# EAGLE design acdr_3.2 (EAGLE 9.6.2)
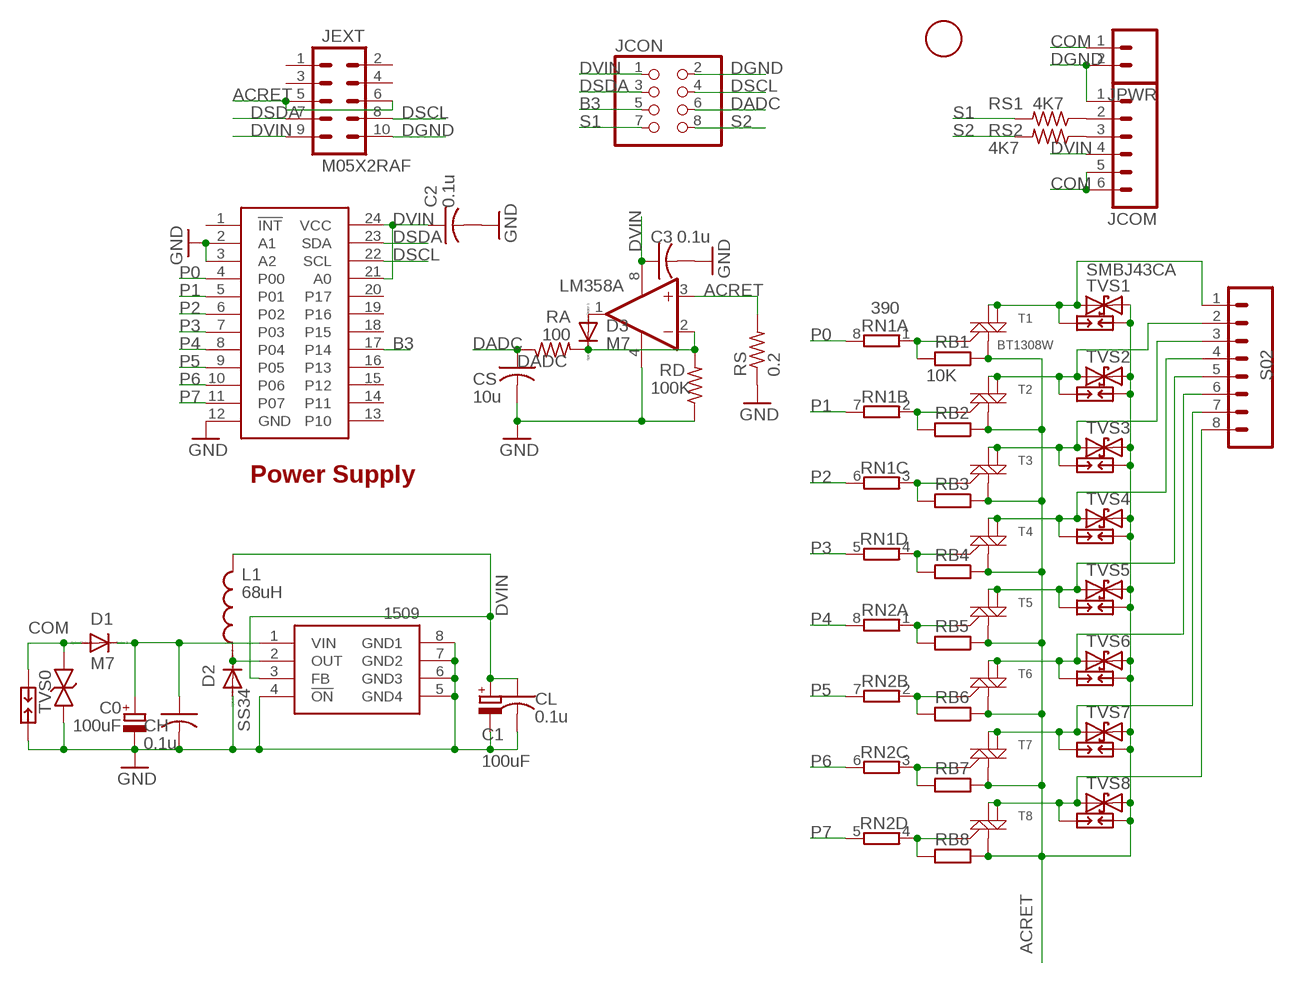
[diagram p0: schematic, sheet 1]

## Parts
1F  FIDUCIAL  [FIDUCIAL_1MM]
1509  34063  XL1509  [SO08]
C0  100uF  CPOL-EUE  [PANASONIC_E]
C1  100uF  CPOL-EUD  [PANASONIC_D]
C2  0.1u  C-USC0603  [C0603]
C3  0.1u  C-USC0603  [C0603]
CH  0.1u  C-USC0603  [C0603]
CL  0.1u  C-USC0603  [C0603]
CS  10u  C-USC0805K  [C0805K]
D1  M7  DIODE-DO-214AC  [DO-214AC]
D2  SS34  DIODE-SMB  [SMB]
D3  M7  DIODE-DO-214AC  [DO-214AC]
JCOM  M065MM  [SCREWTERMINAL-5MM-6]
JCON  PINHD-2X4  [2X04]
JEXT  M05X2RAF  [2X5-RAF]
JPWR  M024MM-X  [SCREWTERMINAL-4MM-2-X]
L1  68uH  INDUCTORPWR  [CDRH125]
LM358  OP262D  [SO08]
PCA9555  PCA9555  PCF8575TSSOP24  [TSSOP24]
RA  100  R-US_R0603  [R0603]
RB1  10K  R-EU_R0603  [R0603]
RB2  10K  R-EU_R0603  [R0603]
RB3  10K  R-EU_R0603  [R0603]
RB4  10K  R-EU_R0603  [R0603]
RB5  10K  R-EU_R0603  [R0603]
RB6  10K  R-EU_R0603  [R0603]
RB7  10K  R-EU_R0603  [R0603]
RB8  10K  R-EU_R0603  [R0603]
RD  100K  R-US_R0603  [R0603]
RN1  390  4R-NEXB38V  [EXB38V]
RN2  4R-NEXB38V  [EXB38V]
RS  0.2  R-US_R2512  [R2512]
RS1  4K7  R-US_R0603  [R0603]
RS2  4K7  R-US_R0603  [R0603]
S02  M085MM-8  [SCREWTERMINAL-5MM-8]
SP0  PCB-SGAP  [PCB-SGAP]
SP1  PCB-SGAP  [PCB-SGAP]
SP2  PCB-SGAP  [PCB-SGAP]
SP3  PCB-SGAP  [PCB-SGAP]
SP4  PCB-SGAP  [PCB-SGAP]
SP5  PCB-SGAP  [PCB-SGAP]
SP6  PCB-SGAP  [PCB-SGAP]
SP7  PCB-SGAP  [PCB-SGAP]
SP8  PCB-SGAP  [PCB-SGAP]
T1  BT1308W  MAC97SOT223  [SOT223]
T2  MAC97SOT223  [SOT223]
T3  MAC97SOT223  [SOT223]
T4  MAC97SOT223  [SOT223]
T5  MAC97SOT223  [SOT223]
T6  MAC97SOT223  [SOT223]
T7  MAC97SOT223  [SOT223]
T8  MAC97SOT223  [SOT223]
TVS0  43CA  DIODE-BTVSSMB  [SMB]
TVS1  SMBJ43CA  TVSSMB  [SMB]
TVS2  TVSSMB  [SMB]
TVS3  TVSSMB  [SMB]
TVS4  TVSSMB  [SMB]
TVS5  TVSSMB  [SMB]
TVS6  TVSSMB  [SMB]
TVS7  TVSSMB  [SMB]
TVS8  TVSSMB  [SMB]

## Nets
ACRET: JEXT.5 JEXT.6 LM358.3(A:+IN) RB1.1 RB2.1 RB3.1 RB4.1 RB5.1 RB6.1 RB7.1 RB8.1 RS.2 SP1.1 SP2.1 SP3.1 SP4.1 SP5.1 SP6.1 SP7.1 SP8.1 T1.1(M1) T2.1(M1) T3.1(M1) T4.1(M1) T5.1(M1) T6.1(M1) T7.1(M1) T8.1(M1) TVS1.C TVS2.C TVS3.C TVS4.C TVS5.C TVS6.C TVS7.C TVS8.C
B3: JCON.5 PCA9555.17(P14)
COM [power]: D1.A JCOM.5 JCOM.6 JPWR.1 SP0.1 TVS0.C
DADC [signal]: CS.1 JCON.6 RA.1
DGND [power]: 1509.4(!ON) 1509.5(GND4) 1509.6(GND3) 1509.7(GND2) 1509.8(GND1) C0.- C1.- C3.2 CH.2 CL.2 CS.2 D2.A JCOM.1 JCON.2 JEXT.10 JPWR.2 LM358.4(P:V-) PCA9555.2(A1) PCA9555.3(A2) PCA9555.12(GND) RD.1 RS.1 SP0.2 TVS0.A ; supply symbol labelled GND
DSCL [signal]: JCON.4 JEXT.8 PCA9555.22(SCL)
DSDA [signal]: JCON.3 JEXT.7 PCA9555.23(SDA)
DVIN [power]: 1509.3(FB) C1.+ C2.1 C3.1 CL.1 JCOM.4 JCON.1 JEXT.9 L1.2 LM358.8(P:V+) PCA9555.21(A0) PCA9555.24(VCC)
GND [power]: C2.2
N$1: JCOM.2 RS1.1
N$3: JCOM.3 RS2.1
N$7: D3.C LM358.2(A:-IN) RA.2 RD.2
N$8: RB1.2 RN1.1 T1.3(G)
N$9: RB2.2 RN1.2 T2.3(G)
N$15: RB3.2 RN1.3 T3.3(G)
N$16: RB4.2 RN1.4 T4.3(G)
N$18: RB5.2 RN2.1 T5.3(G)
N$19: RB6.2 RN2.2 T6.3(G)
N$21: RB7.2 RN2.3 T7.3(G)
N$22: RB8.2 RN2.4 T8.3(G)
N$27: 1509.2(OUT) D2.C L1.1
N$43: D3.A LM358.1(A:OUT)
N$50 [power]: S02.1 SP1.2 T1.2(M2) T1.4(M2-4) TVS1.A
N$51 [power]: S02.2 SP2.2 T2.2(M2) T2.4(M2-4) TVS2.A
N$52 [power]: S02.3 SP3.2 T3.2(M2) T3.4(M2-4) TVS3.A
N$53 [power]: S02.4 SP4.2 T4.2(M2) T4.4(M2-4) TVS4.A
N$54 [power]: S02.5 SP5.2 T5.2(M2) T5.4(M2-4) TVS5.A
N$55 [power]: S02.6 SP6.2 T6.2(M2) T6.4(M2-4) TVS6.A
N$56 [power]: S02.7 SP7.2 T7.2(M2) T7.4(M2-4) TVS7.A
N$57 [power]: S02.8 SP8.2 T8.2(M2) T8.4(M2-4) TVS8.A
P0: PCA9555.4(P00) RN1.8
P1: PCA9555.5(P01) RN1.7
P2: PCA9555.6(P02) RN1.6
P3: PCA9555.7(P03) RN1.5
P4: PCA9555.8(P04) RN2.8
P5: PCA9555.9(P05) RN2.7
P6: PCA9555.10(P06) RN2.6
P7: PCA9555.11(P07) RN2.5
RECAC [power]: 1509.1(VIN) C0.+ CH.1 D1.C
S1 [signal]: JCON.7 RS1.2
S2 [signal]: JCON.8 RS2.2
Unconnected: JEXT.1 JEXT.2 JEXT.3 JEXT.4 LM358.5(B:+IN) LM358.6(B:-IN) LM358.7(B:OUT) PCA9555.1(!INT) PCA9555.13(P10) PCA9555.14(P11) PCA9555.15(P12) PCA9555.16(P13) PCA9555.18(P15) PCA9555.19(P16) PCA9555.20(P17)

## Notes on the sheet
- Power Supply

## Library data of the parts
1F = adafruitGood:FIDUCIAL: For use by pick and place machines to calibrate the vision/machine, 1mm By microbuilder.eu
1509 = adafruit:XL1509
C0 C1 = resistor:CPOL-EU: POLARIZED CAPACITOR, European symbol
C2 C3 CH CL CS = adafruit:C-US: CAPACITOR, American symbol
D1-D3 = diode:DIODE-: DIODE
JCOM = SparkFun:M06: Header 6 Standard 6-pin 0.1" header. Use with straight break away headers (SKU : PRT-00116), right angle break away headers (PRT-00553), swiss pins (PRT-00743), machine pins (PRT-00117), and female headers (PRT-00115). Molex polarized connector foot print use with SKU : PRT-08094 with associated crimp pins and housings. NOTES ON THE VARIANTS LOCK and LOCK_LONGPADS... This footprint was designed to help hold the alignment of a through-hole component (i.e. 6-pin header) while soldering it into place. You may notice that each hole has been shifted either up or down by 0.005 of an inch from it's more standard position (which is a perfectly straight line). This slight alteration caused the pins (the squares in the middle) to touch the edges of the holes. Because they are alternating, it causes a "brace" to hold the component in place. 0.005 has proven to be the perfect amount of "off-center" position when using our standard breakaway headers. Although looks a little odd when you look at the bare footprint, once you have a header in there, the alteration is very hard to notice. Also, if you push a header all the way into place, it is covered up entirely on the bottom side. This idea of altering the position of holes to aid alignment will be further integrated into the Sparkfun Library for other footprints. It can help hold any component with 3 or more connection pins.
JCON = pinhead:PINHD-2X4: PIN HEADER
JEXT = SparkFunNew:M05X2: Header 5x2 Standard 10-pin dual row 0.1" header. Commonly used with AVR-ISP. Use with Spark Fun Electronics SKU: PRT-00778
JPWR = SparkFun:M02: Header 2 Standard 2-pin 0.1" header. Use with straight break away headers (SKU : PRT-00116), right angle break away headers (PRT-00553), swiss pins (PRT-00743), machine pins (PRT-00117), and female headers (PRT-00115). Molex polarized connector foot print use with SKU : PRT-08233 with associated crimp pins and housings.
L1 = SparkFunNew:INDUCTOR: Inductors Basic Inductor/Choke - 0603 and 1206. Footprints are not proven and vary greatly between part numbers.
LM358 = linear:OP262: OP AMP
PCA9555 = SparkFunNew:PCF8575
RA RD RS RS1 RS2 = adafruit2013:R-US_: RESISTOR, American symbol
RB1-RB8 = rcl:R-EU_: RESISTOR, European symbol
RN1 RN2 = resistor-dil:4R-N: Array Chip Resistor Source: RS Component / Phycomp; OC_FARNELL: unknown; OC_NEWARK: unknown
S02 = SparkFun:M08: Header 8 Standard 8-pin 0.1" header. Use with straight break away headers (SKU : PRT-00116), right angle break away headers (PRT-00553), swiss pins (PRT-00743), machine pins (PRT-00117), and female headers (PRT-00115).
SP0 SP1-SP8 = varistor:PCB-SGAP
T1-T8 = SparkFun:MAC97: MAC97 Triac http://www.onsemi.com/pub_link/Collateral/MAC97-D.PDF
TVS0 = diode:DIODE-BTVS
TVS1-TVS8 = SparkFunNew:TVS

## Net classes
0 default: width 0.203 mm, clearance 0.178 mm
1 power: width 0.203 mm, clearance 0.178 mm
2 relaypower: width 0.203 mm, clearance 0.178 mm
3 signal: width 0.203 mm, clearance 0.178 mm
4 adc: width 0.406 mm, clearance 0.178 mm

## Board
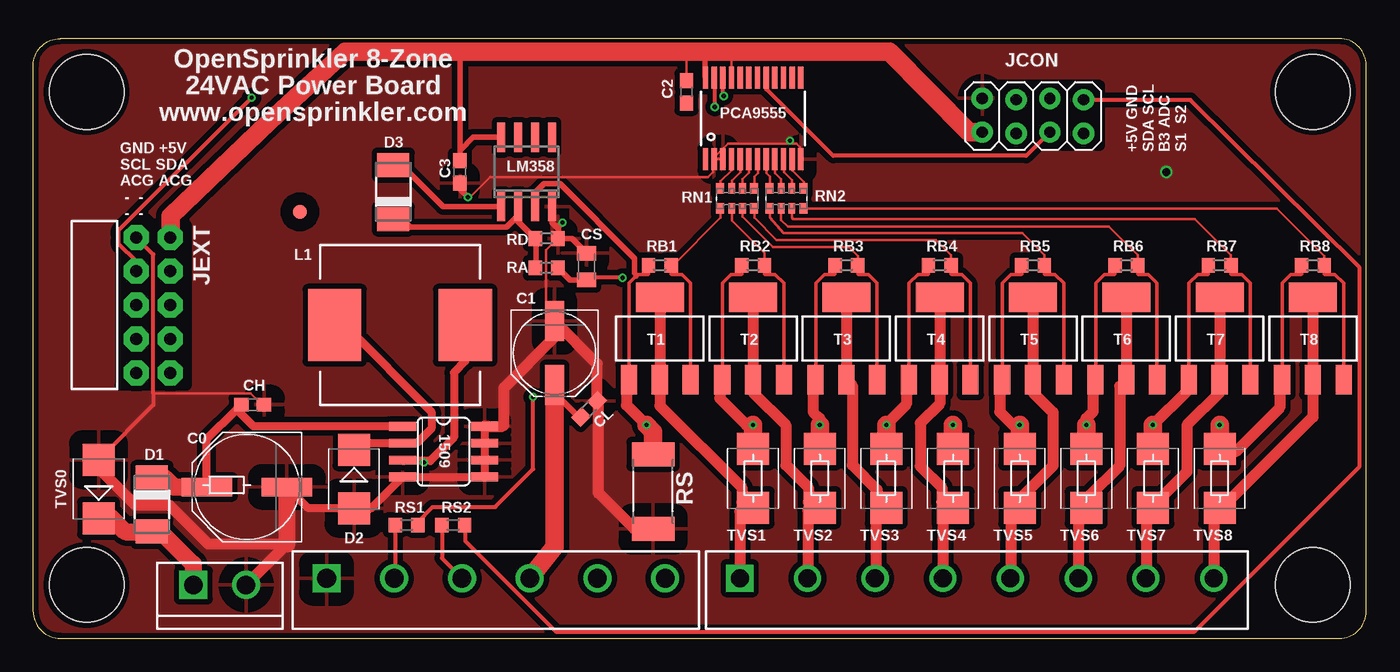
[diagram p1: board, top side]
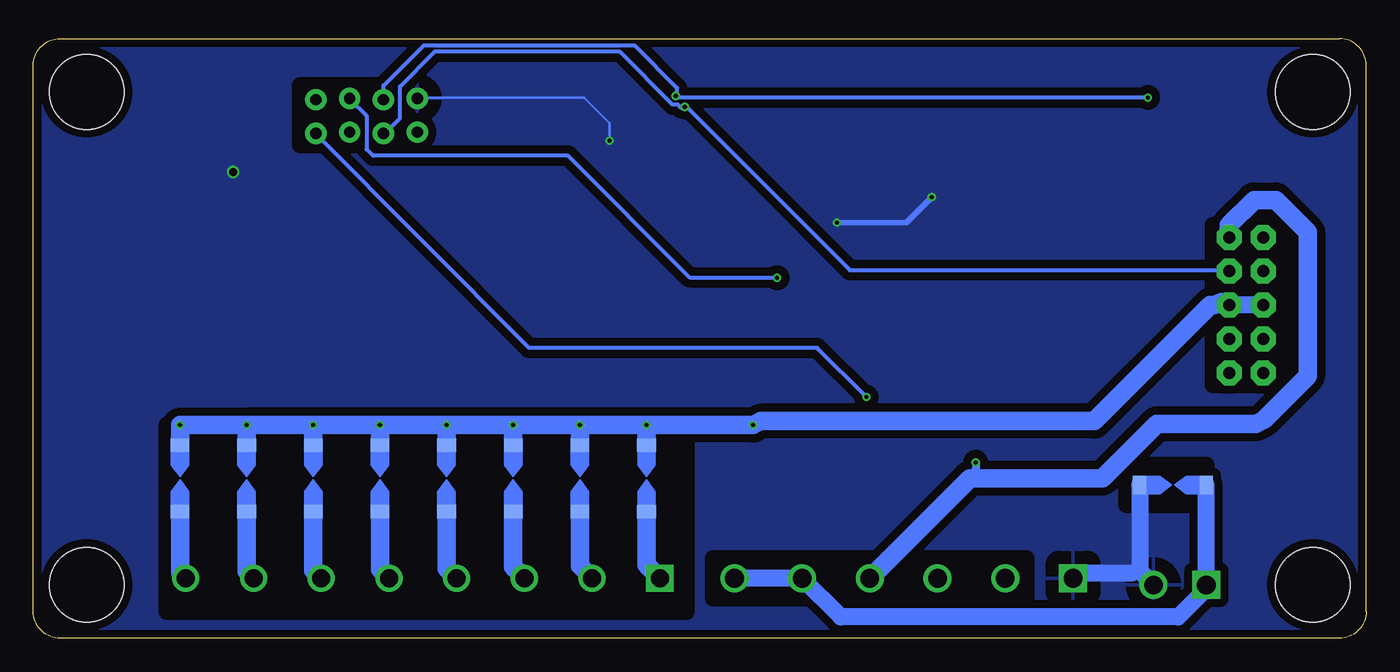
[diagram p2: board, bottom side, seen from below]

Size 100 x 45 mm. Coordinates in mm from the lower left corner, seen from the top.
Outline: 2,0 98,0 arc90 100,2 100,43 arc90 98,45 2,45 arc90 0,43 0,2 arc90 2,0
Copper layers (1*16): Top 0.035mm / dielectric 1.5mm / Bottom 0.035mm
Design rules "Fusion_eagle_rule_v1.1 *": minimum track width 6mil, minimum drill 12mil, track to track 6mil, track to pad 6mil, pad to pad 6mil, via to via 6mil, smd to smd 0mil, copper to edge 10mil, drill to drill 10mil, minimum pad ring 10mil, minimum via ring 6mil, stop-mask expansion 2mil, vias tented up to drill 100mil, thermal gap 40mil
Holes 5.6 mm at 4,4 96,4 4,41 96,41
tRestrict: area 72.5,37 to 80,41.5; area 6.5,19 to 11.5,31
bRestrict: area 51,2 to 90,16; area 12,10 to 18,13; area 72.5,37 to 80,41.5; area 6.5,19 to 11.5,31; area 25.5,3 to 49,6

### Footprints (pad centres in the part's own frame; a part is rotated, then mirrored left to right if it is on the bottom)
FIDUCIAL_1MM = smd 1 x 1: 1 0,0
SO08 = smd 0.66 x 2.032: 1 -1.905,-3.073; 2 -0.635,-3.073; 3 0.635,-3.073; 4 1.905,-3.073; 5 1.905,3.073; 6 0.635,3.073; 7 -0.635,3.073; 8 -1.905,3.073
PANASONIC_E = smd 3.8 x 1.4: + 3,0; - -3,0
PANASONIC_D = smd 3 x 1.4: + 2.4,0; - -2.4,0
C0603 = smd 1.1 x 1: 1 -0.85,0; 2 0.85,0
C0805K = smd 1.1 x 1.4: 1 -1,0; 2 1,0
DO-214AC = smd 1.8 x 2.4: A 2.025,0; C -2.025,0
SMB = smd 2.4 x 2.4: A 2.2,0; C -2.2,0
SCREWTERMINAL-5MM-6 = drill 1.4 pad 2.032 square: 1 0,0 | drill 1.4 pad 2.032: 2 5.08,0; 3 10.16,0; 4 15.24,0; 5 20.32,0; 6 25.4,0
2X04 = drill 0.85 pad 1.6: 1 -3.81,-1.219; 2 -3.81,1.321; 3 -1.27,-1.321; 4 -1.27,1.219; 5 1.27,-1.219; 6 1.27,1.321; 7 3.81,-1.321; 8 3.81,1.219
2X5-RAF = drill 0.9 pad 1.88 octagon: 1 -1.27,5.08; 2 1.27,5.08; 3 -1.27,2.54; 4 1.27,2.54; 5 -1.27,0; 6 1.27,0; 7 -1.27,-2.54; 8 1.27,-2.54; 9 -1.27,-5.08; 10 1.27,-5.08
SCREWTERMINAL-4MM-2-X = drill 1.4 pad 2.032 square: 1 0,0 | drill 1.4 pad 2.032: 2 3.96,0
CDRH125 = smd 5.4 x 4: 1 0,4.9; 2 0,-4.9
SO08' = smd 0.6 x 2.2: 1 -1.905,-2.6; 2 -0.635,-2.6; 3 0.635,-2.6; 4 1.905,-2.6; 5 1.905,2.6; 6 0.635,2.6; 7 -0.635,2.6; 8 -1.905,2.6
TSSOP24 = smd 0.4 x 1.65: 1 -3.575,-3.05; 2 -2.925,-3.05; 3 -2.275,-3.05; 4 -1.625,-3.05; 5 -0.975,-3.05; 6 -0.325,-3.05; 7 0.325,-3.05; 8 0.975,-3.05; 9 1.625,-3.05; 10 2.275,-3.05; 11 2.925,-3.05; 12 3.575,-3.05; 13 3.575,3.05; 14 2.925,3.05; 15 2.275,3.05; 16 1.625,3.05; 17 0.975,3.05; 18 0.325,3.05; 19 -0.325,3.05; 20 -0.975,3.05; 21 -1.625,3.05; 22 -2.275,3.05; 23 -2.925,3.05; 24 -3.575,3.05
R0603 = smd 1 x 1.1: 1 -0.85,0; 2 0.85,0
EXB38V = smd 0.6 x 0.8: 1 -1.275,-0.75; 4 1.275,-0.75; 5 1.275,0.75; 8 -1.275,0.75 | smd 0.5 x 0.8: 2 -0.4,-0.75; 3 0.4,-0.75; 6 0.4,0.75; 7 -0.4,0.75
R2512 = smd 1.8 x 3.2: 1 -2.8,0; 2 2.8,0
SCREWTERMINAL-5MM-8 = drill 1.35 pad 2.032 square: 1 0,0 | drill 1.35 pad 2.032: 2 5.08,0; 3 10.16,0; 4 15.24,0; 5 20.32,0; 6 25.4,0; 7 30.48,0; 8 35.56,0
PCB-SGAP = smd 1 x 1.4 bottom: 1 -2.5,0; 2 2.5,0
SOT223 = smd 1.219 x 2.235: 1 -2.311,-3.099; 2 0,-3.099; 3 2.311,-3.099 | smd 3.6 x 2.2: 4 0,3.099

### Placement (x,y rotation side)
1F  20,32 0 top
1509  30.77,14 270 top
C0  16.02,11.35 180 top
C1  39.1,21.4 270 top
C2  49,41 270 top
C3  32,35 270 top
CH  16.46,17.53 0 top
CL  41.7,17.2 45 top
CS  41.5,27.9 90 top
D1  8.89,10.04 270 top
D2  24.05,11.95 270 top
D3  27,33.5 90 top
JCOM  22,4.5 0 top
JCON  75,39.2 0 top
JEXT  9,25 180 top
JPWR  12,4 0 top
L1  27.5,23.5 90 top
LM358  [SO08']  37,35 0 top
PCA9555  54,39 0 top
RA  38.5,27.8 180 top
RB1  47,28 0 top
RB2  54,28 0 top
RB3  61,28 0 top
RB4  68,28 0 top
RB5  75,28 0 top
RB6  82,28 0 top
RB7  89,28 0 top
RB8  96,28 0 top
RD  38.5,30 180 top
RN1  52.8,33 0 top
RN2  56.5,33 0 top
RS  46.5,11 90 top
RS1  28,8.5 0 top
RS2  31.5,8.5 0 top
S02  53,4.5 0 top
SP0  14.5,11.5 0 top
SP1  54,12 270 top
SP2  59,12 270 top
SP3  64,12 270 top
SP4  69,12 270 top
SP5  74,12 270 top
SP6  79,12 270 top
SP7  84,12 270 top
SP8  89,12 270 top
T1  47,22.5 0 top
T2  54,22.5 0 top
T3  61,22.5 0 top
T4  68,22.5 0 top
T5  75,22.5 0 top
T6  82,22.5 0 top
T7  89,22.5 0 top
T8  96,22.5 0 top
TVS0  4.9,11.2 90 top
TVS1  54,12 270 top
TVS2  59,12 270 top
TVS3  64,12 270 top
TVS4  69,12 270 top
TVS5  74,12 270 top
TVS6  79,12 270 top
TVS7  84,12 270 top
TVS8  89,12 270 top

### Tracks (layer width: path | path; a pad name or v marks a point on that pad's centre or on a via)
ACRET  (via drill 0.3)
  Top 0.254: RB1.1 46.15,27.35 46.1,27.3 45.35,27.3 45.22,27.17 44.7,26.65 44.7,19.8 T1.1 | RB2.1 53.15,27.35 53.1,27.3 52.35,27.3 51.7,26.65 51.7,19.8 T2.1 | RB3.1 60.15,27.35 60.1,27.3 59.35,27.3 58.7,26.65 58.7,19.8 T3.1 | RB4.1 67.15,27.35 67.1,27.3 66.35,27.3 65.7,26.65 65.7,19.8 T4.1 | RB5.1 74.15,27.35 74.1,27.3 73.35,27.3 72.7,26.65 72.7,19.8 T5.1 | RB6.1 81.15,27.35 81.1,27.3 80.35,27.3 79.7,26.65 79.7,19.8 T6.1 | RB7.1 88.15,27.35 88.1,27.3 87.35,27.3 86.7,26.65 86.7,19.8 T7.1 | RB8.1 95.15,27.35 95.1,27.3 94.35,27.3 93.7,26.65 93.7,19.8 T8.1
  Top 0.406: LM358.3 37.6,32.4 37.6,33.4 38.3,34.1 39.5,34.1 45.1,28.5 45.1,27.4 45.22,27.17
  Top 0.813: TVS8.C 89.5,14 90.2,14 93.5,17.3 93.5,19 T8.1 | v84,16 86.5,18.5 86.5,19 T7.1 | v79,16 79,16.5 79.5,17 79.5,19 T6.1 | v74,16 73.5,16 72.5,17 72.5,19 T5.1 | v64,16 64,16.05 65.5,17.55 65.5,19 T4.1 | v59,16 59,16.5 58.5,17 58.5,19 T3.1 | v54,16 53.5,16 51.5,18 51.5,19 T2.1 | v46,16 44.5,17.5 44.5,19 T1.1
  Top 1.4: v54,16 TVS1.C | v59,16 TVS2.C | v64,16 TVS3.C | v69,16 TVS4.C | v74,16 TVS5.C | v79,16 TVS6.C | v84,16 TVS7.C | v89,16 TVS8.C | RS.2 46.5,15.5 v46,16
  Bottom 1.27: JEXT.6 JEXT.5 10.85,25.25
  Bottom 1.4: SP1.1 v54,16 | SP2.1 v59,16 | SP3.1 v64,16 | SP4.1 v69,16 | SP5.1 v74,16 | SP6.1 v79,16 | SP7.1 v84,16 | SP8.1 v89,16 v84,16 | v79,16 v84,16 | v74,16 v79,16 | v69,16 v74,16 | v64,16 v69,16 | v59,16 v64,16 | v54,16 v59,16 | v54,16 v46,16 45.4,16.3 20.4,16.3 11.7,25 11.4,25 10.85,25.25
B3
  Top 0.305: PCA9555.17 55,42 55,41.2 60,36.2 74.5,36.2 76.2,37.9 JCON.5
COM
  Top 1.27: JPWR.1 12,5.55 9.55,8 D1.A 8.25,8 6.9,8 5.9,9 TVS0.C
  Bottom 1.27: JCOM.6 JCOM.5 39.42,1.6 14.1,1.6 12,3.7 JPWR.1 SP0.1
DADC  (via drill 0.3)
  Top 0.203: 41.62,27.05 CS.1
  Top 0.305: v44.2,27.05 41.62,27.05
  Top 0.406: CS.1 40.25,26.9 RA.1
  Bottom 0.305: v44.2,27.05 50.67,27.05 50.8,27.1 59.9,36.2 74.5,36.2 75,36.7 75,39.2 76.3,40.5 JCON.6
DGND  (via drill 0.3, 0.6)
  Top 0.203: PCA9555.3 51.62,36 51.12,36 PCA9555.2 | PCA9555.2 51,35.88 51,35 50.62,34.62 34.25,34.62 32.75,33.12 v32.6,33.1 | 56.77,37.12 52.12,37.12 51,36 PCA9555.2 | 56.77,37.12 57.25,37.12 57.5,36.88 57.5,36 PCA9555.12 | 5.14,13.72 TVS0.A | 19.05,11.34 C0.- | 56.77,37.12 v56.77,37.34 | 9,18.38 16.29,18.38 17.05,17.62 17.24,17.62 CH.2 | RD.1 39.24,29.91 38.48,29.15 38.48,24.57 39.05,24 C1.-
  Top 0.305: JEXT.10 9,28.81 9,18.38 9,17.5 TVS0.A
  Top 0.406: 39.4,30.7 39.4,30 | 39.4,30.7 38.9,31.2 LM358.4 | 39.4,30 RD.1 | 39.4,30 40.4,30 CS.2 | v39.7,31.2 39.4,30.9 39.4,30.7 | v32.6,33.1 32,33.7 C3.2 | 39.08,23.82 C1.-
  Top 0.61: 1509.8 1509.7 1509.6 1509.5 1509.4 25.36,9.75 D2.A 20.62,9.75 C0.-
  Top 0.813: TVS0.A 4.9,12.75 7.65,10 10.2,10 13.14,7.06 19.02,7.06 JPWR.2 | RS.1 45.1,8.2 42.4,10.9 42.4,17.4 CL.2 42.3,20.6 C1.- 39.2,23.2 39.1,23.1 39.1,22.6 35.3,18.8 35.3,16 35.2,15.9 34.1,15.9 1509.8
  Top 1.27: C0.- 19.02,7.06
  Bottom 0.203: v56.77,37.34 56.77,38.67 58.67,40.58 71.15,40.58 JCON.2
  Bottom 0.406: v39.7,31.2 34.5,31.2 v32.6,33.1
  Bottom 1.27: SP0.2 17,5.04 | 17,5.04 JPWR.2 | JCOM.1 21.6,4.9 17.6,4.9 17,5.04
  other vias: 85,35
  pour Top (isolate 0.406): 0,45 100,45 100,0 0,0
  pour Bottom (isolate 0.61): 0,45 100,45 100,0 0,0
DSCL  (via drill 0.3)
  Top 0.305: v16.38,40.58 6.38,30.57 6.38,29.62 7.71,28.29 7.71,27.62 JEXT.8 | v51.8,40.7 51.7,40.8 51.7,42 PCA9555.22
  Bottom 0.305: JCON.4 73.73,41.47 70.7,44.5 54.9,44.5 51.7,41.3 51.7,40.8 v51.8,40.7 51.68,40.58 v16.38,40.58
DSDA  (via drill 0.3)
  Top 0.305: v51.12,39.88 51.12,42 PCA9555.23
  Bottom 0.305: JEXT.7 10.38,27.62 38.75,27.62 51,39.88 v51.12,39.88 | 51.24,39.81 v51.12,39.88 | JCON.3 73.7,37.85 72.5,39.05 72.5,41.4 69.9,44 56,44 52.05,40.05 51.65,40.05 51.4,39.8 v51.12,39.88
DVIN  (via drill 0.3)
  Top 0.203: 49,44 C2.1 | 50.38,42.12 PCA9555.24 | 52.38,44 PCA9555.21 | 40.9,16.6 41.05,16.67 CL.1 41.05,16.76 | 39.43,19.14 39.24,19.14 39.15,19.05 | 39.15,19.05 C1.+ | 39.15,19.05 39.1,18.4
  Top 0.406: LM358.8 33,37.6 32,36.6 | C3.1 32,36.6 | 32,36.6 32,44 | 52.38,43.62 52,44 | 40.9,16.6 39.1,18.4 | 50.38,42.12 50.38,43.67 50.7,44
  Top 0.61: 29.3,13.3 29.77,13.3 31.55,15.07 31.55,19.94 32.4,20.79 L1.2 | 29.3,13.3 27.77,13.3 1509.3 | v29.3,13.2 29.3,13.3
  Top 1.4: JEXT.9 arc45 10.3,30.15 10.3,31.7 17.71,38.81 23.4,44 32,44 49,44 50.7,44 52,44 52.38,44 64.25,44 70.19,37.98 JCON.1 | 39.1,18.4 39.1,6.86 JCOM.4
  Bottom 0.61: v29.3,13.2 29.3,12.7 29.18,12.4 29.18,12
  Bottom 1.4: JEXT.9 10.3,30.1 10.3,31 8.4,32.9 6.8,32.9 4.4,30.5 4.4,19.7 7.7,16.4 8.3,16.1 15.7,16.1 19.8,12 29.18,12 29.74,12 JCOM.4
N$1
  Top 0.254: 27.15,4.57 JCOM.2
  Top 0.305: RS1.1 27.15,4.57
N$3
  Top 0.305: RS2.1 30.65,6.01 JCOM.3
N$7
  Top 0.406: RA.2 37.7,28.5 37.7,29.8 RD.2 37.5,30.14 36.28,31.36 LM358.2 36.36,31.72 35.5,30.86 28.26,30.86 27.64,31.48 D3.C
N$8
  Top 0.203: RB1.2 47.95,28.05 48.05,28.05 51.55,31.55 51.55,32.25 RN1.1
  Top 0.254: RB1.2 47.85,27.35 47.9,27.3 48.65,27.3 49.3,26.65 49.3,19.45 T1.3
N$9
  Top 0.203: RB2.2 54.85,28.9 52.4,31.35 RN1.2
  Top 0.254: RB2.2 54.85,27.35 54.9,27.3 55.65,27.3 56.3,26.65 56.3,19.45 T2.3
N$15
  Top 0.203: RN1.3 53.2,31.65 55.5,29.35 61.2,29.35 61.85,28.7 RB3.2
  Top 0.254: RB3.2 61.85,27.35 61.9,27.3 62.65,27.3 63.3,26.65 63.3,19.45 T3.3
N$16
  Top 0.203: RN1.4 54.1,32.25 54.1,31.55 55.75,29.9 67.7,29.9 68.85,28.75 RB4.2
  Top 0.254: RB4.2 68.85,27.35 68.9,27.3 69.65,27.3 70.3,26.65 70.3,19.45 T4.3
N$18
  Top 0.203: RN2.1 55.25,32.25 55.25,31.55 56.29,30.4 74.2,30.4 75.85,28.75 RB5.2
  Top 0.254: RB5.2 75.85,27.35 75.9,27.3 76.65,27.3 77.3,26.65 77.3,19.45 T5.3
N$19
  Top 0.203: RN2.2 56.1,31.4 56.6,30.9 80.7,30.9 82.85,28.75 RB6.2
  Top 0.254: RB6.2 82.85,27.35 82.9,27.3 83.65,27.3 84.3,26.65 84.3,19.45 T6.3
N$21
  Top 0.203: RN2.3 56.9,31.55 57,31.45 87.15,31.45 89.85,28.75 RB7.2
  Top 0.254: RB7.2 89.85,27.35 89.9,27.3 90.65,27.3 91.3,26.65 91.3,19.45 T7.3
N$22
  Top 0.203: 57.85,32.25 57.8,32.3 57.75,32.25 RN2.4 93.3,32.25 96.85,28.7 RB8.2
  Top 0.254: RB8.2 96.85,27.35 96.9,27.3 97.65,27.3 98.3,26.65 98.3,19.45 T8.3
N$27
  Top 0.61: D2.C 24.54,14.63 1509.2 27.73,14.66 28.8,14.66 29.88,15.74 29.88,17 23.38,23.5 L1.1
N$43
  Top 0.406: LM358.1 30.76,32.4 27.64,35.52 D3.A
N$50
  Top 0.813: S02.1 53,9.5 53.3,9.8 TVS1.A 53.15,10.2 53.15,11.3 47,17.45 T1.2 T1.4
  Bottom 1.4: SP1.2 54,5.5 S02.1
N$51
  Top 0.813: S02.2 58.1,4.5 58.1,9.6 58.3,9.8 TVS2.A 58.15,10.2 58.15,11.3 56.45,13 56.45,16 54,18.45 T2.2 T2.4
  Bottom 1.4: SP2.2 59,5.42 S02.2
N$52
  Top 0.813: S02.3 63.2,4.5 63.2,9.55 63.45,9.8 TVS3.A 63.3,10.2 63.3,11.15 61.45,13 61.45,18.95 T3.2 T3.4
  Bottom 1.4: SP3.2 64,5.34 S02.3
N$53
  Top 0.813: S02.4 68.25,9.75 68.3,9.8 TVS4.A 68.15,10.2 68.15,11.3 66.55,12.9 66.55,16.15 68,17.6 T4.2 T4.4
  Bottom 1.4: SP4.2 69,5.26 S02.4
N$54
  Top 0.813: S02.5 73.35,4.5 73.35,9.75 73.4,9.8 TVS5.A 74.15,10.2 74.15,10.6 76.5,12.95 76.5,16.95 75,18.45 T5.2 T5.4
  Bottom 1.4: SP5.2 74,5.18 S02.5
N$55
  Top 0.813: S02.6 78.4,9.75 78.45,9.8 TVS6.A 79.15,10.2 79.15,10.6 81.5,12.95 81.5,18.9 T6.2 T6.4
  Bottom 1.4: SP6.2 79,5.1 S02.6
N$56
  Top 0.813: S02.7 83.5,4.5 83.5,9.75 83.55,9.8 TVS7.A 84.09,10.04 86.55,12.5 86.55,16 89,18.45 T7.2 T7.4
  Bottom 1.4: SP7.2 84,5.02 S02.7
N$57
  Top 0.813: S02.8 88.55,9.75 88.6,9.8 TVS8.A 89.2,9.8 96,16.6 T8.2 T8.4
  Bottom 1.4: SP8.2 89,4.94 S02.8
P0
  Top 0.203: RN1.8 51.55,33.75 51.55,34.3 52.4,35.15 52.4,35.95 PCA9555.4
P1
  Top 0.203: RN1.7 52.4,34.35 53.05,35 53.05,35.95 PCA9555.5
P2
  Top 0.203: RN1.6 53.2,34.45 53.7,34.95 53.7,35.95 PCA9555.6
P3
  Top 0.203: RN1.5 54.1,33.75 54.1,34.65 54.35,34.9 54.35,35.95 PCA9555.7
P4
  Top 0.203: RN2.8 55.25,33.75 55.25,34.65 55,34.9 55,35.95 PCA9555.8
P5
  Top 0.203: RN2.7 56.1,34.45 55.65,34.9 55.65,35.95 PCA9555.9
P6
  Top 0.203: RN2.6 56.9,34.4 56.3,35 56.3,35.95 PCA9555.10
P7
  Top 0.203: RN2.5 57.8,33.75 57.8,34.25 56.95,35.1 56.95,35.95 PCA9555.11
RECAC
  Top 0.61: C0.+ 13.02,14.94 15.25,17.17 | 15.25,17.17 CH.1 | 1509.1 16.52,15.9 15.25,17.17
  Top 1.27: C0.+ 10.55,11.35 9.85,12.05 D1.C
S1  (via drill 0.3)
  Top 0.305: RS1.2 28.85,8.75 29.95,9.85 34.65,9.85 37.5,12.7 v37.5,18.1
  Bottom 0.305: v37.5,18.1 41.2,21.8 62.81,21.8 JCON.7
S2
  Top 0.305: RS2.2 32.4,8.5 32.4,7.3 39.2,0.5 87.1,0.5 99.5,12.9 99.5,27.81 86.81,40.4 78.9,40.4 JCON.8

### Text on the board
tNames: OpenSprinkler 8-Zone | 24VAC Power Board | www.opensprinkler.com | +5V GND / SDA SCL / B3 ADC / S1 S2 | GND +5V / SCL SDA / ACG ACG / - - / - -